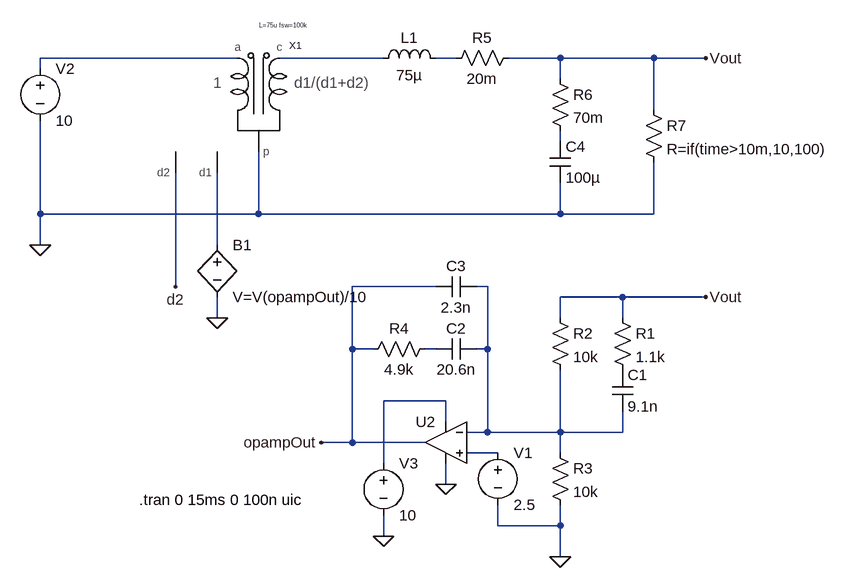
[diagram p0: schematic test_DCM_VM.asc]
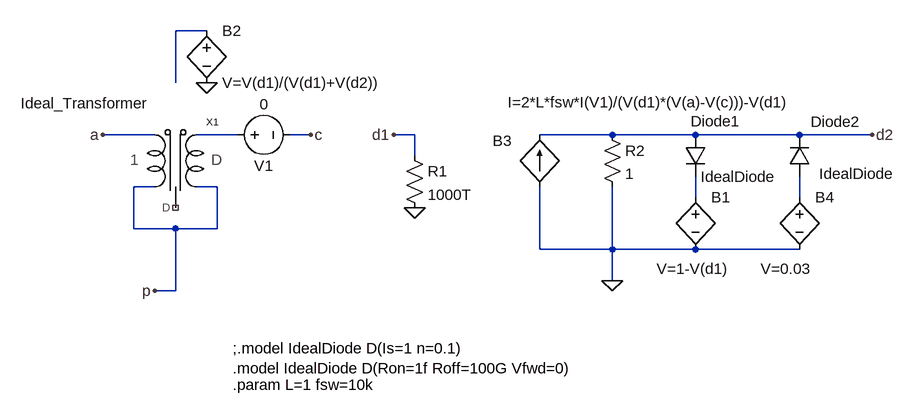
[diagram p1: sub-circuit dcm_vm_transformer_model.asc]
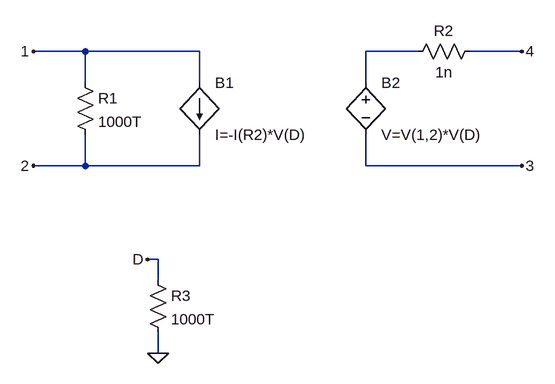
[diagram p2: sub-circuit ideal_transformer.asc]
test_DCM_VM.asc, the LTspice schematic file:
Version 4
SHEET 1 1144 756
WIRE -80 -32 -384 -32
WIRE 144 -32 -16 -32
WIRE 256 -32 224 -32
WIRE 416 -32 336 -32
WIRE 560 -32 416 -32
WIRE 640 -32 560 -32
WIRE -384 -16 -384 -32
WIRE 416 0 416 -32
WIRE 560 48 560 -32
WIRE 416 96 416 80
WIRE -384 208 -384 64
WIRE -48 208 -48 112
WIRE -48 208 -384 208
WIRE 416 208 416 160
WIRE 416 208 -48 208
WIRE 560 208 560 128
WIRE 560 208 416 208
WIRE -384 256 -384 208
WIRE -112 256 -112 144
WIRE -176 320 -176 144
WIRE 224 320 96 320
WIRE 304 320 288 320
WIRE 512 336 416 336
WIRE 640 336 512 336
WIRE -112 368 -112 336
WIRE 416 368 416 336
WIRE 512 368 512 336
WIRE 96 416 96 320
WIRE 128 416 96 416
WIRE 224 416 208 416
WIRE 304 416 304 320
WIRE 304 416 288 416
WIRE 240 496 144 496
WIRE 240 528 240 496
WIRE 304 544 304 416
WIRE 304 544 272 544
WIRE 416 544 416 448
WIRE 416 544 304 544
WIRE 512 544 512 512
WIRE 512 544 416 544
WIRE 96 560 96 416
WIRE 96 560 48 560
WIRE 208 560 96 560
WIRE 320 576 272 576
WIRE 416 576 416 544
WIRE 144 592 144 496
WIRE 240 624 240 592
WIRE 320 688 320 656
WIRE 416 688 416 656
WIRE 416 688 320 688
WIRE 144 704 144 672
WIRE 416 736 416 688
FLAG 416 736 0
FLAG -384 256 0
FLAG 240 624 0
FLAG 144 704 0
FLAG 640 336 Vout
FLAG 640 -32 Vout
FLAG 48 560 opampOut
FLAG -112 368 0
FLAG -176 320 d2
SYMBOL res 496 352 R0
SYMATTR InstName R1
SYMATTR Value 1.1k
SYMBOL cap 496 448 R0
SYMATTR InstName C1
SYMATTR Value 9.1n
SYMBOL res 400 352 R0
SYMATTR InstName R2
SYMATTR Value 10k
SYMBOL res 400 560 R0
SYMATTR InstName R3
SYMATTR Value 10k
SYMBOL voltage 320 560 R0
WINDOW 123 0 0 Left 0
WINDOW 39 0 0 Left 0
SYMATTR InstName V1
SYMATTR Value 2.5
SYMBOL cap 288 400 R90
WINDOW 0 0 32 VBottom 2
WINDOW 3 32 32 VTop 2
SYMATTR InstName C2
SYMATTR Value 20.6n
SYMBOL cap 288 304 R90
WINDOW 0 0 32 VBottom 2
WINDOW 3 32 32 VTop 2
SYMATTR InstName C3
SYMATTR Value 2.3n
SYMBOL res 224 400 R90
WINDOW 0 0 56 VBottom 2
WINDOW 3 32 56 VTop 2
SYMATTR InstName R4
SYMATTR Value 4.9k
SYMBOL voltage -384 -32 R0
WINDOW 123 0 0 Left 0
WINDOW 39 0 0 Left 0
SYMATTR InstName V2
SYMATTR Value 10
SYMBOL ind 128 -16 R270
WINDOW 0 32 56 VTop 2
WINDOW 3 5 56 VBottom 2
SYMATTR InstName L1
SYMATTR Value 75µ
SYMBOL res 352 -48 R90
WINDOW 0 0 56 VBottom 2
WINDOW 3 32 56 VTop 2
SYMATTR InstName R5
SYMATTR Value 20m
SYMBOL res 400 -16 R0
SYMATTR InstName R6
SYMATTR Value 70m
SYMBOL cap 400 96 R0
SYMATTR InstName C4
SYMATTR Value 100µ
SYMBOL voltage 144 576 R0
WINDOW 123 0 0 Left 0
WINDOW 39 0 0 Left 0
SYMATTR InstName V3
SYMATTR Value 10
SYMBOL res 544 32 R0
SYMATTR InstName R7
SYMATTR Value R=if(time>10m,10,100)
SYMBOL DCM_VM_transformer_model -96 -48 R0
WINDOW 39 49 -35 Left 0
SYMATTR SpiceLine L=75u fsw=100k
SYMATTR InstName X1
SYMBOL bv -112 240 R0
SYMATTR InstName B1
SYMATTR Value V=V(opampOut)/10
SYMBOL OpAmps\\UniversalOpAmp2 240 560 M0
SYMATTR InstName U2
TEXT -232 648 Left 2 !.tran 0 15ms 0 100n uic

dcm_vm_transformer_model.asc, the sub-circuit schematic file:
Version 4
SHEET 1 1344 680
WIRE 240 -16 192 -16
WIRE 192 64 192 -16
WIRE 160 144 80 144
WIRE 288 144 224 144
WIRE 400 144 368 144
WIRE 560 144 528 144
WIRE 864 144 752 144
WIRE 992 144 864 144
WIRE 1152 144 992 144
WIRE 1264 144 1152 144
WIRE 560 176 560 144
WIRE 160 224 128 224
WIRE 256 224 224 224
WIRE 992 240 992 208
WIRE 1152 240 1152 208
WIRE 128 288 128 224
WIRE 192 288 128 288
WIRE 256 288 256 224
WIRE 256 288 192 288
WIRE 752 320 752 224
WIRE 864 320 864 224
WIRE 864 320 752 320
WIRE 992 320 864 320
WIRE 1152 320 992 320
WIRE 864 368 864 320
WIRE 192 384 192 288
WIRE 192 384 160 384
FLAG 240 64 0
FLAG 528 144 d1
FLAG 560 256 0
FLAG 864 368 0
FLAG 1264 144 d2
FLAG 400 144 c
FLAG 80 144 a
FLAG 160 384 p
SYMBOL ideal_transformer 144 128 R0
WINDOW 3 -190 -33 Left 2
SYMATTR InstName X1
SYMBOL bv 992 224 R0
WINDOW 3 -60 126 Left 2
SYMATTR Value V=1-V(d1)
SYMATTR InstName B1
SYMBOL bv 240 -32 R0
SYMATTR InstName B2
SYMATTR Value V=V(d1)/(V(d1)+V(d2))
SYMBOL res 544 160 R0
SYMATTR InstName R1
SYMATTR Value 1000T
SYMBOL diode 976 144 R0
WINDOW 0 9 -21 Left 2
SYMATTR InstName Diode1
SYMATTR Value IdealDiode
SYMBOL bi2 752 144 R0
WINDOW 0 -72 9 Left 2
WINDOW 3 -49 -50 Left 2
SYMATTR InstName B3
SYMATTR Value I=2*L*fsw*I(V1)/(V(d1)*(V(a)-V(c)))-V(d1)
SYMBOL res 848 128 R0
SYMATTR InstName R2
SYMATTR Value 1
SYMBOL diode 1168 208 R180
WINDOW 0 -78 84 Left 2
WINDOW 3 -130 4 Left 2
SYMATTR InstName Diode2
SYMATTR Value IdealDiode
SYMBOL bv 1152 224 R0
WINDOW 3 -60 126 Left 2
SYMATTR Value V=0.03
SYMATTR InstName B4
SYMBOL voltage 272 144 R270
WINDOW 0 -32 56 VBottom 2
WINDOW 3 32 56 VTop 2
WINDOW 123 0 0 Left 0
WINDOW 39 0 0 Left 0
SYMATTR InstName V1
SYMATTR Value 0
TEXT 280 472 Left 2 !;.model IdealDiode D(Is=1 n=0.1)\n.model IdealDiode D(Ron=1f Roff=100G Vfwd=0)
TEXT 280 528 Left 2 !.param L=1 fsw=10k

ideal_transformer.asc, the sub-circuit schematic file:
Version 4
SHEET 1 880 680
WIRE -192 80 -272 80
WIRE -16 80 -192 80
WIRE 320 80 240 80
WIRE 480 80 400 80
WIRE -192 128 -192 80
WIRE -16 128 -16 80
WIRE 240 128 240 80
WIRE -192 256 -192 208
WIRE -192 256 -272 256
WIRE -16 256 -16 208
WIRE -16 256 -192 256
WIRE 240 256 240 208
WIRE 480 256 240 256
WIRE -80 400 -96 400
WIRE -80 432 -80 400
WIRE -80 544 -80 512
FLAG -80 544 0
FLAG -96 400 D
FLAG -272 80 1
FLAG -272 256 2
FLAG 480 80 4
FLAG 480 256 3
SYMBOL res -208 112 R0
SYMATTR InstName R1
SYMATTR Value 1000T
SYMBOL res 416 64 R90
WINDOW 0 0 56 VBottom 2
WINDOW 3 32 56 VTop 2
SYMATTR InstName R2
SYMATTR Value 1n
SYMBOL bi -16 128 R0
SYMATTR InstName B1
SYMATTR Value I=-I(R2)*V(D)
SYMBOL res -96 416 R0
SYMATTR InstName R3
SYMATTR Value 1000T
SYMBOL bv 240 112 R0
SYMATTR InstName B2
SYMATTR Value V=V(1,2)*V(D)

The netlist it stands for:
* test_DCM_VM.asc
R1 Vout P001 1.1k
C1 P001 N006 9.1n
R2 Vout N006 10k
R3 N006 0 10k
V1 N009 0 2.5
C2 N006 N007 20.6n
C3 N006 opampOut 2.3n
R4 N007 opampOut 4.9k
V2 N001 0 10
L1 N002 N003 75µ
R5 Vout N003 20m
R6 Vout N004 70m
C4 N004 0 100µ
V3 N008 0 10
R7 Vout 0 R=if(time>10m,10,100)
XX1 N001 d2 0 N002 N005 dcm_vm_transformer_model params: L=75u fsw=100k
B1 N005 0 V=V(opampOut)/10
XU2 N009 N006 N008 0 opampOut level2 Avol=1Meg GBW=10Meg Slew=10Meg Ilimit=25m Rail=0 Vos=0 En=0 Enk=0 In=0 Ink=0 Rin=500Meg  ; pins In+ In- V+ V- OUT

* block symbol definitions
.subckt dcm_vm_transformer_model a d2 p c d1
XX1 a p p N002 NC_01 ideal_transformer params: Ideal_Transformer
B1 N003 0 V=1-V(d1)
B2 N001 0 V=V(d1)/(V(d1)+V(d2))
R1 d1 0 1000T
Diode1 d2 N003 IdealDiode
B3 0 d2 I=2*L*fsw*I(V1)/(V(d1)*(V(a)-V(c)))-V(d1)
R2 d2 0 1
Diode2 N004 d2 IdealDiode
B4 N004 0 V=0.03
V1 N002 c 0
;.model IdealDiode D(Is=1 n=0.1)
.model IdealDiode D(Ron=1f Roff=100G Vfwd=0)
.param L=1 fsw=10k
.ends dcm_vm_transformer_model

.subckt ideal_transformer 1 2 3 4 D
R1 1 2 1000T
R2 4 N001 1n
B1 1 2 I=-I(R2)*V(D)
R3 D 0 1000T
B2 N001 3 V=V(1,2)*V(D)
.ends ideal_transformer

.model D D
.lib standard.dio
.tran 0 15ms 0 100n uic
.lib UniversalOpAmp2.lib
.backanno
.end